# Altium schematic sheet MCU.SchDoc
size A; SheetNumber: 4; SheetTotal: 5
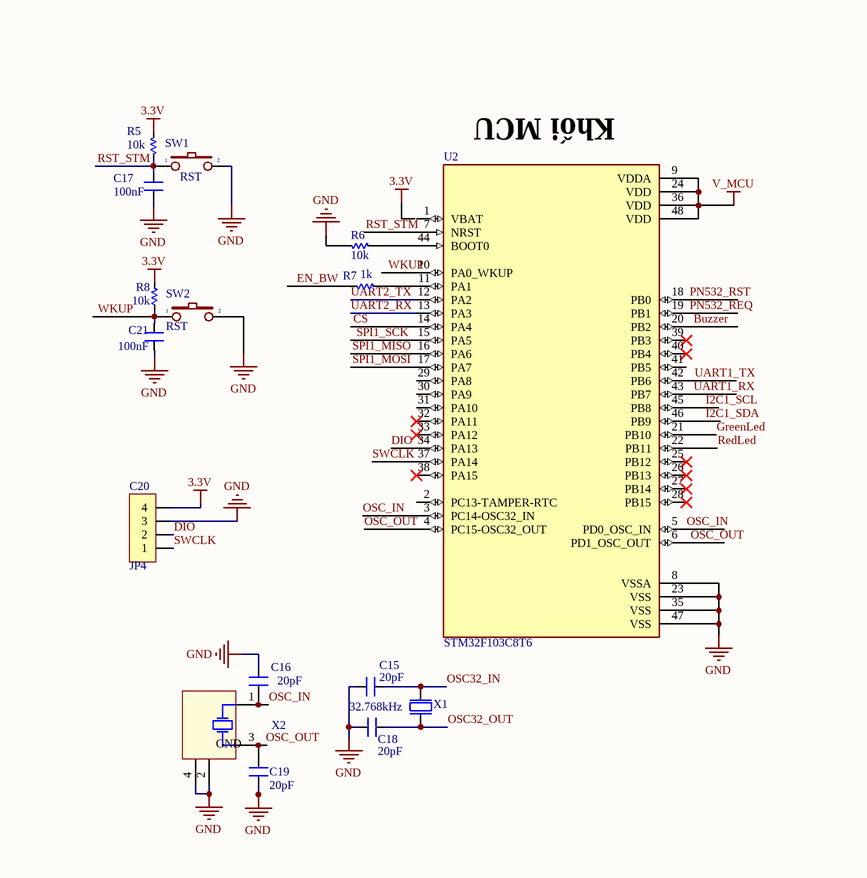
[diagram p0: MCU.SchDoc, left]
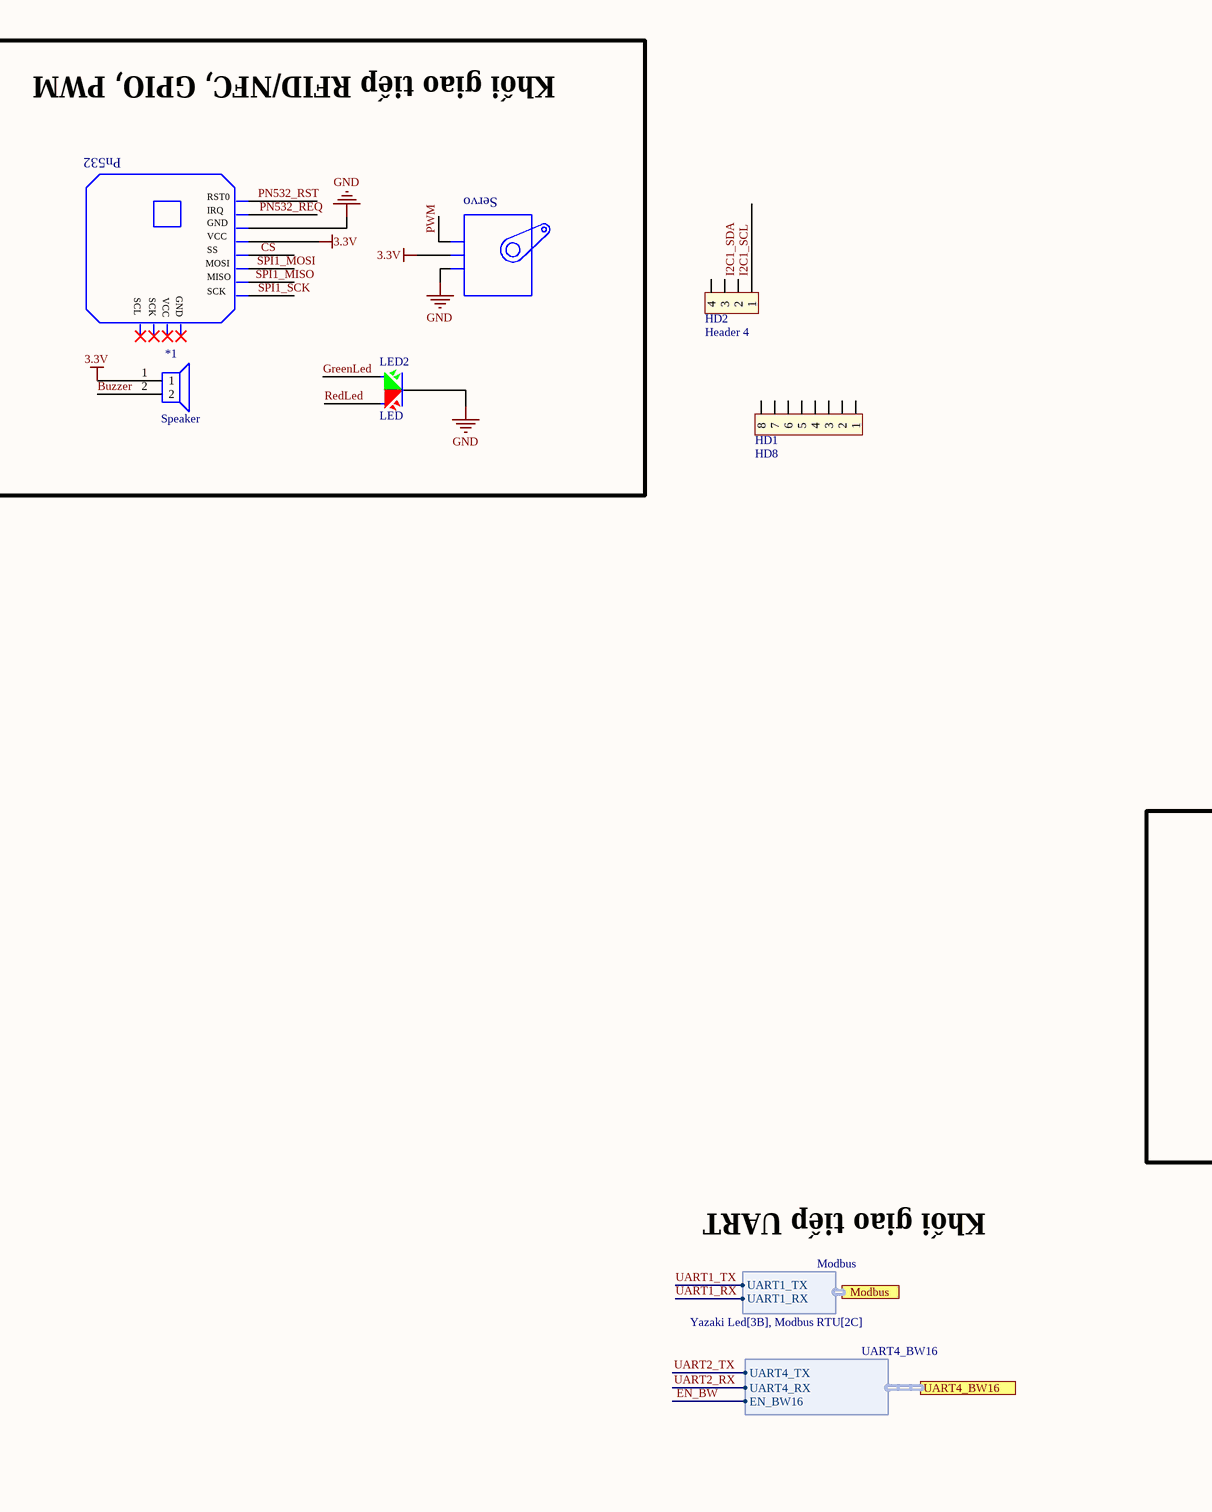
[diagram p1: MCU.SchDoc, right]

## Parts
*1  Speaker  [SPEAKER]
C15  20pF  [CN-SMD-0603]
C16  20pF  [CN-SMD-0603]
C17  100nF  [CN-SMD-0603]
C18  20pF  [CN-SMD-0603]
C19  20pF  [CN-SMD-0603]
C20  JP4  [JP4-C1T]
C21  100nF  [CN-SMD-0603]
HD1  HD8  [Header_8]
HD2  Header 4  [Header_4]
LED2  LED  [LED-52]
R5  10k  [RES-SMD-0603]
R6  10k  [RES-SMD-0603]
R7  1k  [RES-SMD-0603]
R8  10k  [RES-SMD-0603]
SW1  RST  [SW1-SMD]
SW2  RST  [SW1-SMD]
U2  STM32F103C8T6  [QFP50P900X900X160-48N]
X1  32.768kHz  [XTAL_3215]
X2  XT4  [XT4-16.000MHz-4_V]  (value not drawn)

## Ports
Modbus (harness Modbus, see Yazaki Led[3B], Modbus RTU[2C]), UART4_BW16 (harness UART4_BW16, see Yazaki Led[2B], Wireless_Master[2C])

## Harnesses
Modbus: UART1_TX, UART1_RX
UART4_BW16: UART4_TX, UART4_RX, EN_BW16

## Nets
3.3V: *1.1 C20.4 R5.1 R8.1
GND: C15.1 C16.2 C17.2 C18.1 C19.1 C20.3 LED2.2 R6.2 SW1.2 SW2.2 U2.8(VSSA) U2.23(VSS) U2.35(VSS) U2.47(VSS) X2.2(GND) X2.4(GND)
V_MCU: U2.9(VDDA) U2.24(VDD) U2.36(VDD) U2.48(VDD)
Buzzer: *1.2 U2.20(PB2)
CS: U2.14(PA4)
DIO: C20.2 U2.34(PA13)
EN_BW: R7.1 ; port UART4_BW16.EN_BW16
GreenLed: LED2.3 U2.21(PB10)
I2C1_SCL: HD2.1 U2.45(PB8)
I2C1_SDA: U2.46(PB9)
OSC32_IN: C15.2 X1.2(out)
OSC32_OUT: C18.2 X1.1(inp)
OSC_IN: C16.1 U2.3(PC14-OSC32_IN) U2.5(PD0_OSC_IN) X2.1(XTAL)
OSC_OUT: C19.2 U2.4(PC15-OSC32_OUT) U2.6(PD1_OSC_OUT) X2.3(XTAL)
PN532_REQ: U2.19(PB1)
PN532_RST: U2.18(PB0)
RedLed: LED2.1 U2.22(PB11)
RST_STM: C17.1 R5.2 SW1.1 U2.7(NRST)
SPI1_MISO: U2.16(PA6)
SPI1_MOSI: U2.17(PA7)
SPI1_SCK: U2.15(PA5)
SWCLK: C20.1 U2.37(PA14)
UART1_RX: U2.43(PB7) ; port Modbus.UART1_RX
UART1_TX: U2.42(PB6) ; port Modbus.UART1_TX
UART2_RX: U2.13(PA3) ; port UART4_BW16.UART4_RX
UART2_TX: U2.12(PA2) ; port UART4_BW16.UART4_TX
WKUP: R8.2 SW2.1 U2.10(PA0_WKUP)
NetR6_1: R6.1 U2.44(BOOT0)
NetR7_2: R7.2 U2.11(PA1)

Not connected (* = marked no-connect by the designer): C21 1 2; HD1 1 2 3 4 5 6 7 8; HD2 2 3 4; U2 1(VBAT) 2(PC13-TAMPER-RTC) 25(PB12)* 26(PB13)* 27(PB14)* 28(PB15)* 29(PA8) 30(PA9) 31(PA10) 32(PA11)* 33(PA12)* 38(PA15)* 39(PB3)* 40(PB4)* 41(PB5)

## Notes on the sheet
- Khối giao tiếp RFID/NFC, GPIO, PWM
- Pn532
- RST0
- IRQ
- GND
- Servo
- SCL
- SCK
- VCC
- MOSI
- SS
- MISO
- (near U2) Khối MCU
- Khối giao tiếp UART
- Labels drawn without touching a wire or pin: I2C1_SDA

## Library data of the parts
C15-C19 = CN: Value: 33pF
C20 = JP4: WR-PHD 2.54 mm Angled Socket Header; Manufacturer: W¨¹rth Elektronik eiSos GmbH; partNo: 613004143121; ComponentLink1 Description: Manufacturer; ComponentLink2 Description: Datasheet; NoPins: 04; Created Date: 29 March 2013; ComponentLink1URL: http://www.we-online.com; ComponentLink2URL: http://katalog.we-online.de/em/datasheet/6130xx143121.pdf; Created by: Karrer Zheng
C21 = CN_2: Value: 33pF
HD1 = Header8: Header 8; Creat by: VanDungEvn@Gmail.com
HD2 = Header4: Value: Header 4
LED2 = LED2: LED 2 colour Green and Red; Value: LED 3 - 5 ly 2 Colour
R5-R7 = Res-SMD: Resistor; Manufacturer: Generic Components; Class: Passive; Published: 08/06/2000; Publisher: Altium Hobart Technology Centre
R8 = Res-SMD_1: Resistor; Manufacturer: Generic Components; Class: Passive; Published: 08/06/2000; Publisher: Altium Hobart Technology Centre
SW1 SW2 = SW2: Switch button 2 pin; Value: SW chip 2 pin
U2 = STM32F103C8T6: ARMÂ® CortexÂ®-M3 STM32F1 Microcontroller IC 32-Bit 72MHz 64KB (64K x 8) FLASH 48-LQFP (7x7); MF: STMicroelectronics; Package: LQFP-48 STMicroelectronics; Price: None; Check_prices: https://www.snapeda.com/parts/STM32F103C8T6/STMicroelectronics/view-part/?ref=eda; Value: *; SnapEDA_Link: https://www.snapeda.com/parts/STM32F103C8T6/STMicroelectronics/view-part/?ref=snap; MP: STM32F103C8T6; Availability: In Stock; Purchase-URL: https://pricing.snapeda.com/search/part/STM32F103C8T6/?ref=eda
X1 = XTAL_SMD3215: XTAL SMD 3215, 32.768kHz, Cl=9pF, Total Tol: ±50ppm; Part Number: XTAL_SMD3215_32.768kHz_9pF_General; Manufacturer: *; Manufacturer Part Number: *; LatestRevisionDate: 2016-08-19; Pin Count: 2; Publisher: Nordic Semiconductor; Published: 2016-08-19; Value: 32.768kHz; Footprint Doc: XTAL_3215
X2 = XT4: Crystal, 16 MHz, -30 to 85 degC, 3.2 x 2.5 x 0.9 mm SMD; Value: 4Mhz